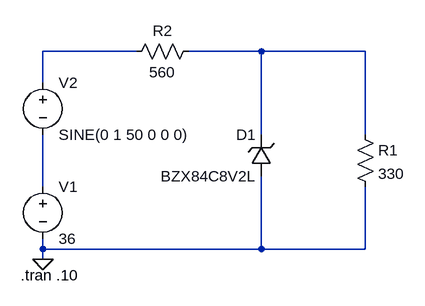
[diagram p0: schematic problema1.asc]
problema1.asc, the LTspice schematic file:
Version 4
SHEET 1 880 680
WIRE 224 32 80 32
WIRE 416 32 304 32
WIRE 576 32 416 32
WIRE 80 80 80 32
WIRE 416 160 416 32
WIRE 576 160 576 32
WIRE 80 240 80 160
WIRE 80 336 80 320
WIRE 416 336 416 224
WIRE 416 336 80 336
WIRE 576 336 576 240
WIRE 576 336 416 336
WIRE 80 352 80 336
FLAG 80 352 0
SYMBOL voltage 80 224 R0
SYMATTR InstName V1
SYMATTR Value 36
SYMBOL voltage 80 64 R0
WINDOW 123 0 0 Left 0
WINDOW 39 0 0 Left 0
SYMATTR InstName V2
SYMATTR Value SINE(0 1 50 0 0 0)
SYMBOL res 560 144 R0
SYMATTR InstName R1
SYMATTR Value 330
SYMBOL res 320 16 R90
WINDOW 0 0 56 VBottom 2
WINDOW 3 32 56 VTop 2
SYMATTR InstName R2
SYMATTR Value 560
SYMBOL zener 432 224 R180
WINDOW 0 24 64 Left 2
WINDOW 3 24 0 Left 2
SYMATTR InstName D1
SYMATTR Value BZX84C8V2L
TEXT 46 376 Left 2 !.tran .10

The netlist it stands for:
* problema1.asc
V1 N003 0 36
V2 N001 N003 SINE(0 1 50 0 0 0)
R1 N002 0 330
R2 N002 N001 560
D1 0 N002 BZX84C8V2L
.model D D
.lib standard.dio
.tran .10
.backanno
.end